# EAGLE design 405_led_jetracer020001S (EAGLE 9.6.2)

## Sheet 1 of 2
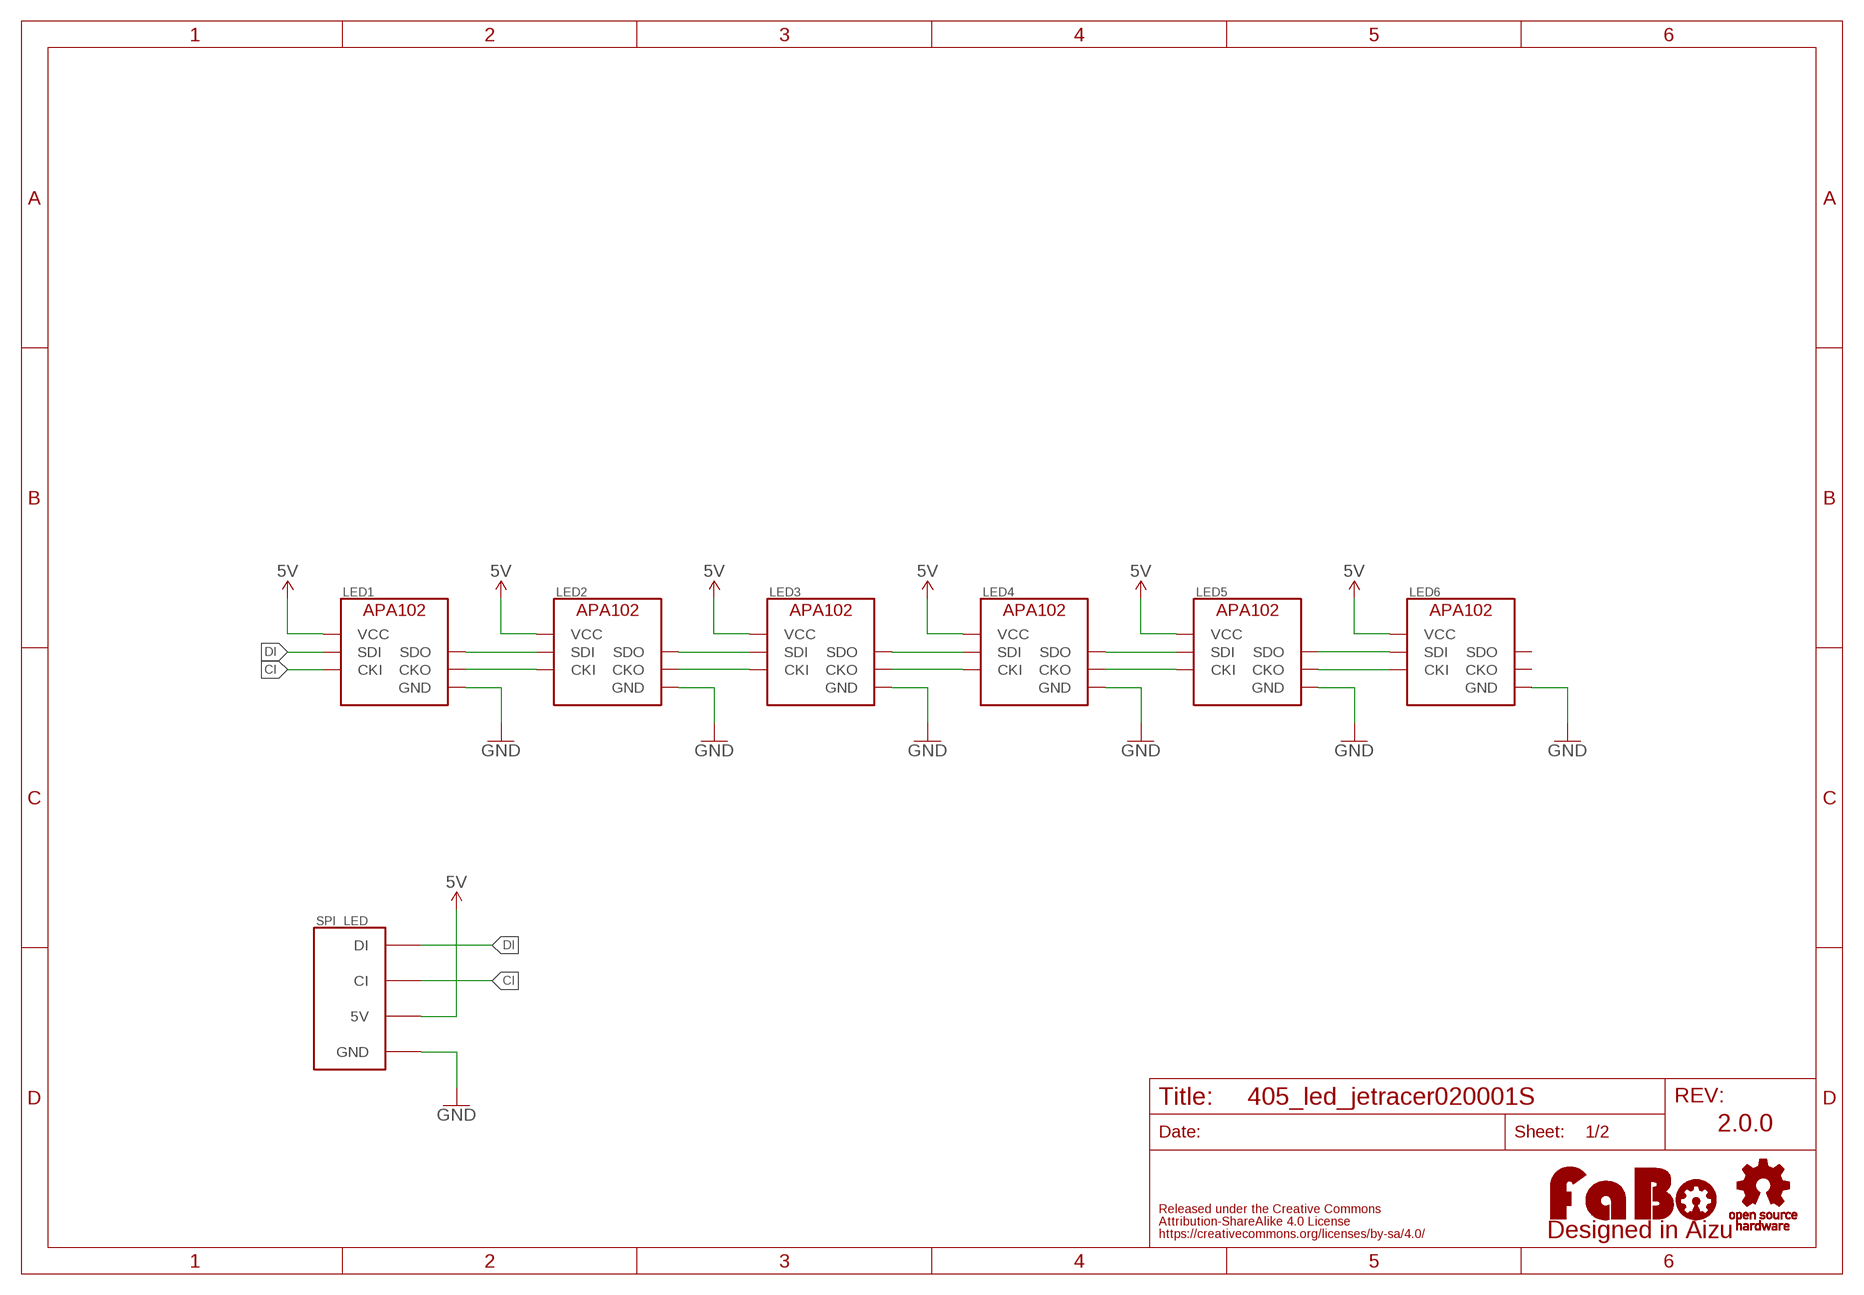
[diagram p0: schematic, sheet 1]

### Parts
LED1  APA102_IPIXEL  [APA102_2020]
LED2  APA102_IPIXEL  [APA102_2020]
LED3  APA102_IPIXEL  [APA102_2020]
LED4  APA102_IPIXEL  [APA102_2020]
LED5  APA102_IPIXEL  [APA102_2020]
LED6  APA102_IPIXEL  [APA102_2020]
LOGO1  LOGO_OSHW-S_BOTTOM  [LOGO_OSHW_S_BOTTOM]
LOGO2  LOGO_FABO-S  [LOGO_FABO_S]
SPI_LED  SPI-LED  FABO_BRICK_SPI_LED-S04B-PASK-2  [FABO_BRICK_SPI_LED_S04B-PASK-2]

### Nets
5V: LED1.VCC LED2.VCC LED3.VCC LED4.VCC LED5.VCC LED6.VCC SPI_LED.5V
CI: LED1.CKI SPI_LED.CI
CI1: LED1.CKO LED2.CKI
CI2: LED2.CKO LED3.CKI
CI3: LED3.CKO LED4.CKI
CI4: LED4.CKO LED5.CKI
CI5: LED5.CKO LED6.CKI
DI: LED1.SDI SPI_LED.DI
DI1: LED1.SDO LED2.SDI
DI2: LED2.SDO LED3.SDI
DI3: LED3.SDO LED4.SDI
DI4: LED4.SDO LED5.SDI
DI5: LED5.SDO LED6.SDI
GND: LED1.GND LED2.GND LED3.GND LED4.GND LED5.GND LED6.GND SPI_LED.GND
Unconnected: LED6.CKO LED6.SDO

### Notes on the sheet
- 2.0.0

## Sheet 2 of 2
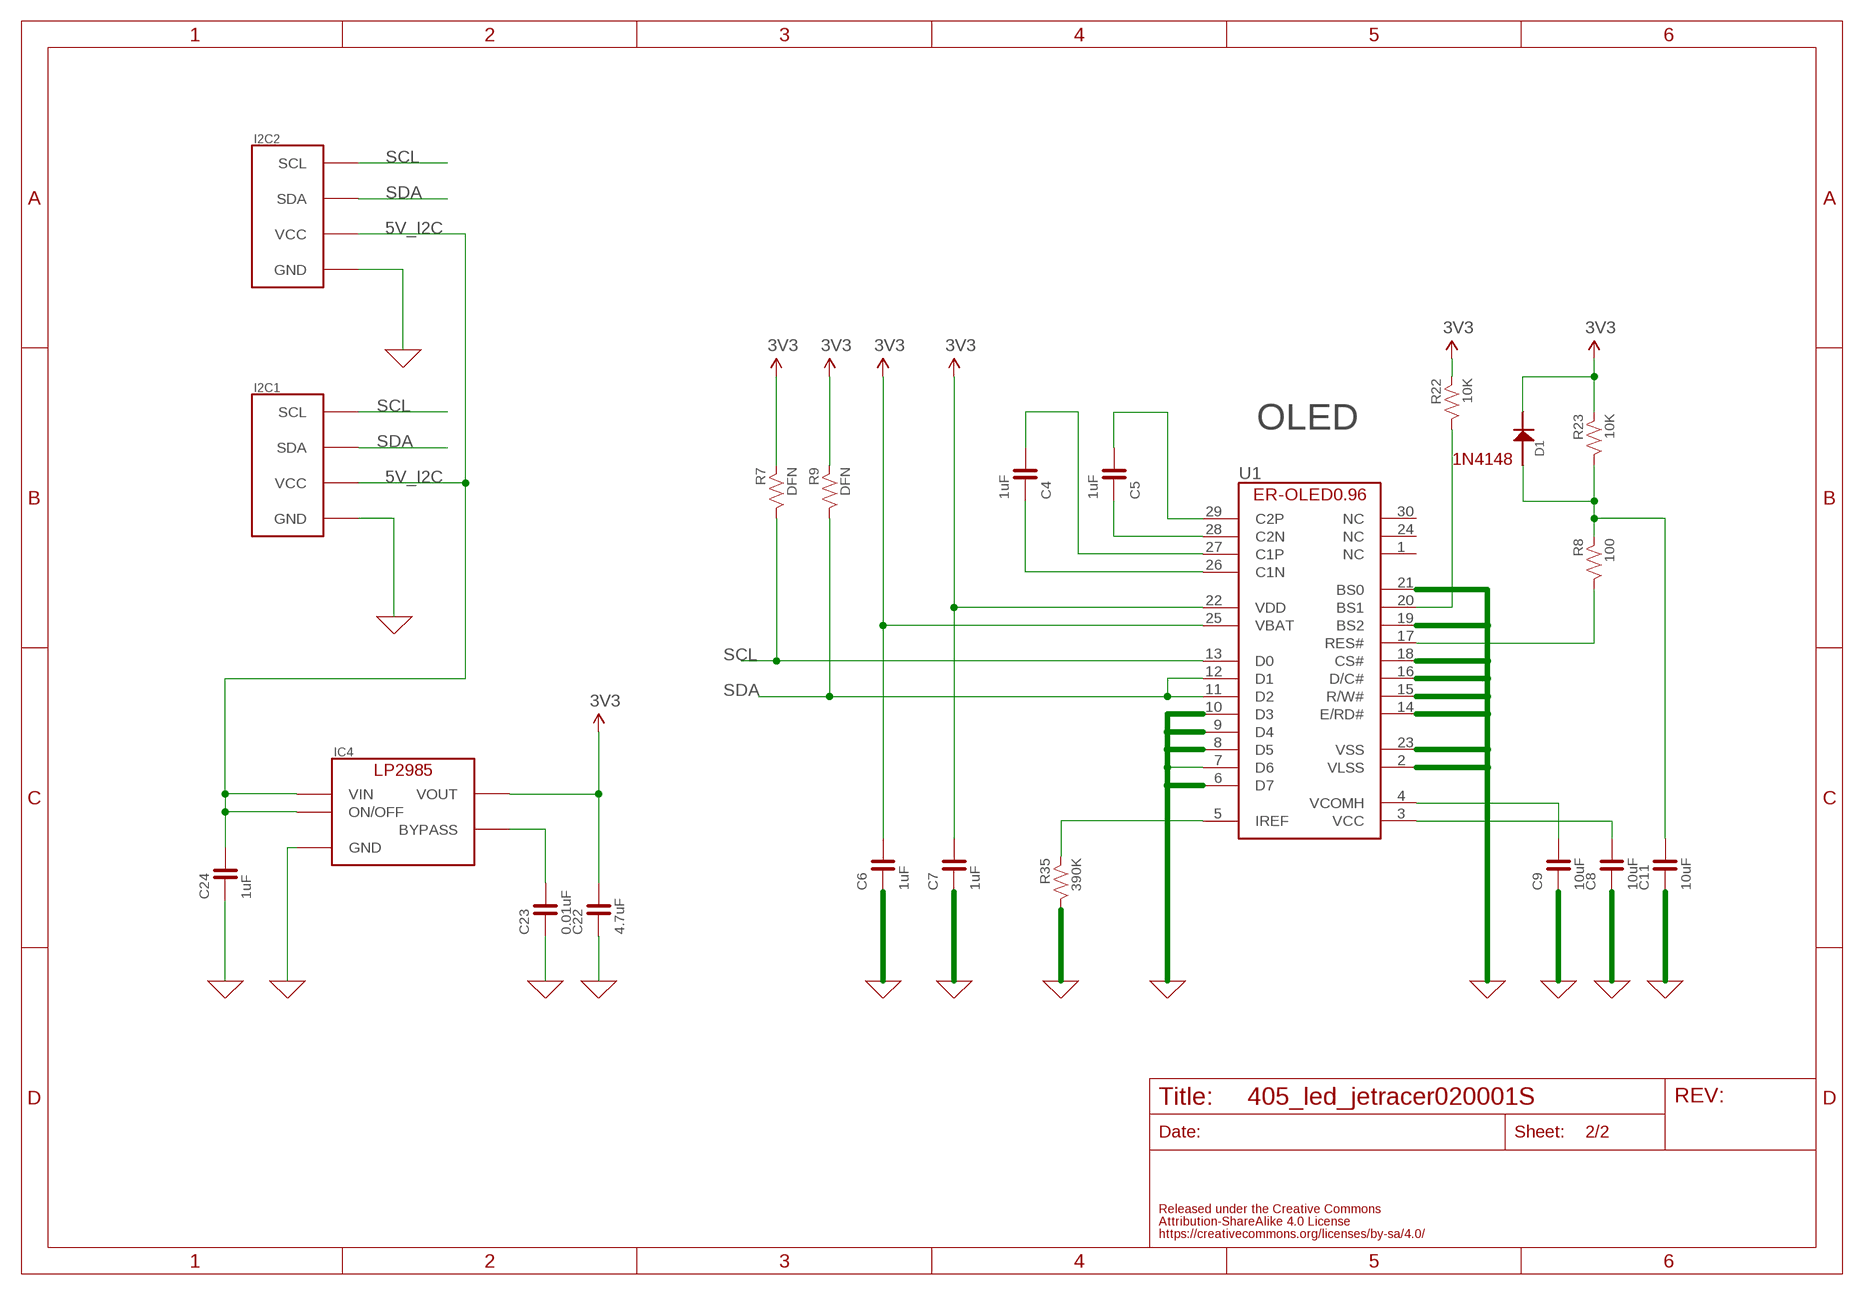
[diagram p1: schematic, sheet 2]

### Parts
C4  1uF  CAPACITOR-0603  [0603]
C5  1uF  CAPACITOR-0603  [0603]
C6  1uF  CAPACITOR-0603  [0603]
C7  1uF  CAPACITOR-0603  [0603]
C8  10uF  CAPACITOR-0603  [0603]
C9  10uF  CAPACITOR-0603  [0603]
C11  10uF  CAPACITOR-0603  [0603]
C22  4.7uF  CAPACITOR-0603  [0603]
C23  0.01uF  CAPACITOR-0603  [0603]
C24  1uF  CAPACITOR-0603  [0603]
D1  1N4148  [1N4148W]
I2C1  FABO_BRICK_I2C-S04B-PASK-2  [FABO_BRICK_I2C_S04B-PASK-2]
I2C2  FABO_BRICK_I2C-S04B-PASK-2  [FABO_BRICK_I2C_S04B-PASK-2]
IC4  LP2985-33DBV  [SOT-23-5]
R7  DFN  RESISTOR-0603  [0603]
R8  100  RESISTOR-0603  [0603]
R9  DFN  RESISTOR-0603  [0603]
R22  10K  RESISTOR-0603  [0603]
R23  10K  RESISTOR-0603  [0603]
R35  390K  RESISTOR-0603  [0603]
U1  ER-OLED0.96-1ER-CON30HT-1  [ER-CON30HT-1]

### Nets
0: C6.1 C7.1 C8.1 C9.1 C11.1 C22.1 C23.1 C24.1 I2C1.GND I2C2.GND IC4.2(GND) R35.2 U1.2(VLSS) U1.6(D7) U1.7(D6) U1.8(D5) U1.9(D4) U1.10(D3) U1.14(E/RD#) U1.15(R/W#) U1.16(D/C#) U1.18(CS#) U1.19(BS2) U1.21(BS0) U1.23(VSS) ; supply symbol labelled GND
3V3: C6.2 C7.2 C22.2 D1.CATHODE IC4.5(VOUT) R7.1 R9.1 R22.1 R23.1 U1.22(VDD) U1.25(VBAT)
5V_I2C: C24.2 I2C1.VCC I2C2.VCC IC4.1(VIN) IC4.3(ON/OFF)
N$2: C23.2 IC4.4(BYPASS)
N$16: C4.2 U1.27(C1P)
N$21: C4.1 U1.26(C1N)
N$22: C5.1 U1.28(C2N)
N$23: C5.2 U1.29(C2P)
N$24: R35.1 U1.5(IREF)
N$25: C9.2 U1.4(VCOMH)
N$26: C8.2 U1.3(VCC)
N$27: R8.2 U1.17(RES#)
N$28: C11.2 D1.ANODE R8.1 R23.2
N$50: R22.2 U1.20(BS1)
SCL: I2C1.SCL I2C2.SCL R7.2 U1.13(D0)
SDA: I2C1.SDA I2C2.SDA R9.2 U1.11(D2) U1.12(D1)
Unconnected: U1.1(NC) U1.24(NC) U1.30(NC)

### Notes on the sheet
- OLED
- 1N4148

## Library data of the parts
C4-C9 C11 C22-C24 = FaBo-Capacitor:CAPACITOR: CAPACITOR
D1 = FaBo-Diode:1N4148
I2C1 I2C2 = FaBo-Template:FABO_BRICK_I2C: FaBo Brick I2C
IC4 = FaBo-Supply:LP2985: LP2985
LED1-LED6 = FaBo-LED:APA102
LOGO1 = FaBo-Logo:LOGO_OSHW
LOGO2 = FaBo-Logo:LOGO_FABO
R7-R9 R22 R23 R35 = FaBo-Resistors:RESISTOR: RESISTOR
SPI_LED = FaBo-Template:FABO_BRICK_SPI_LED
U1 = FaBo-Display:ER-OLED0.96-1

## Board
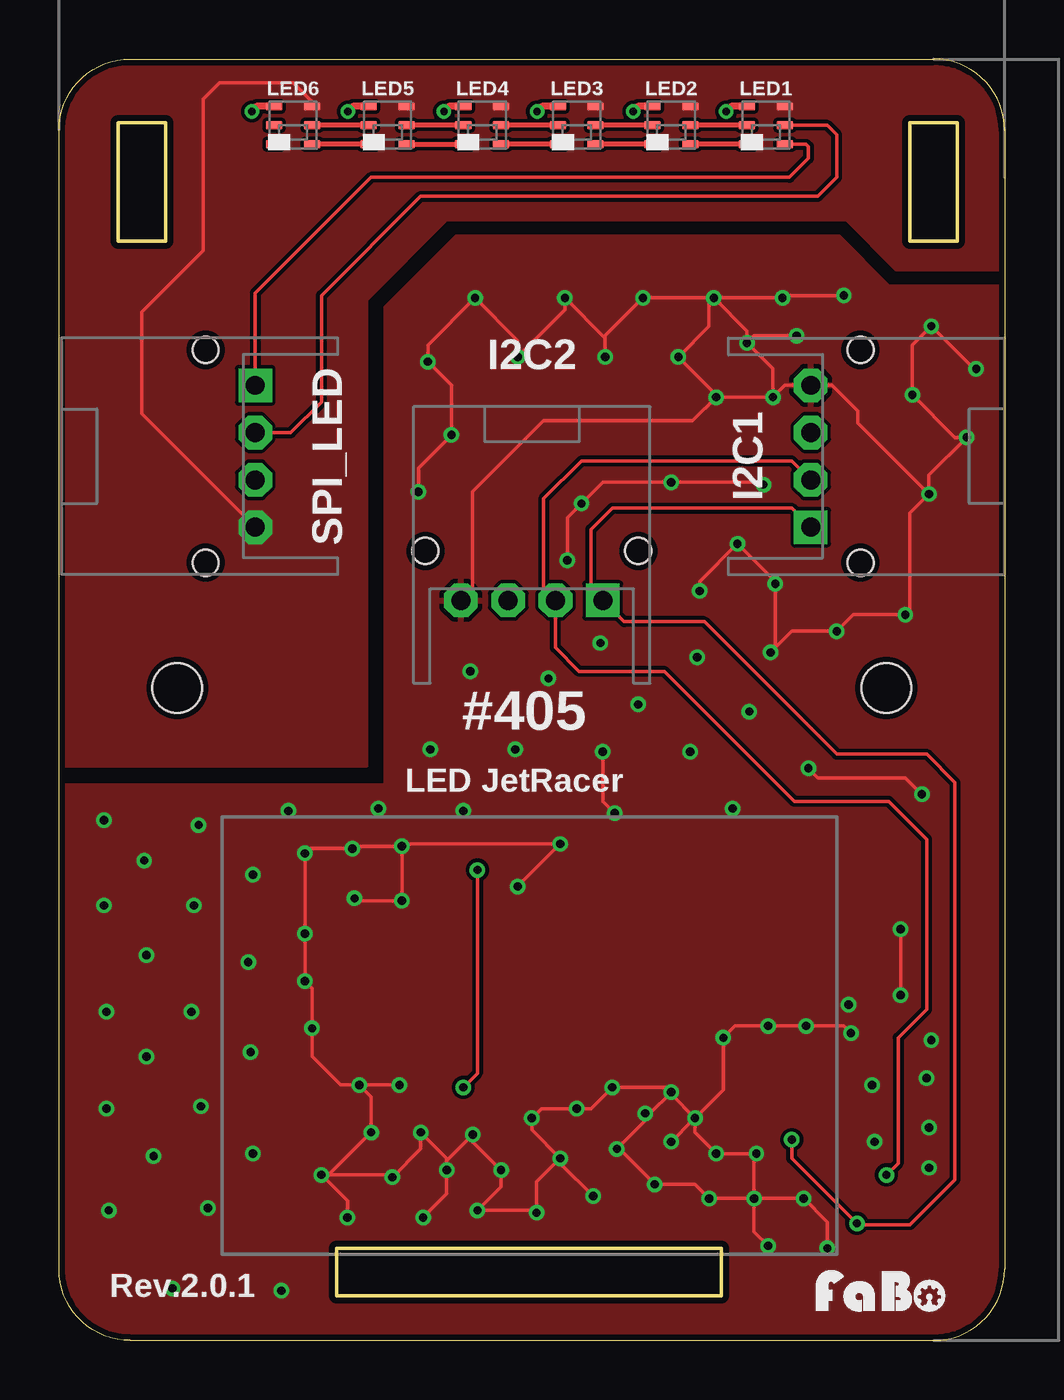
[diagram p2: board, top side]
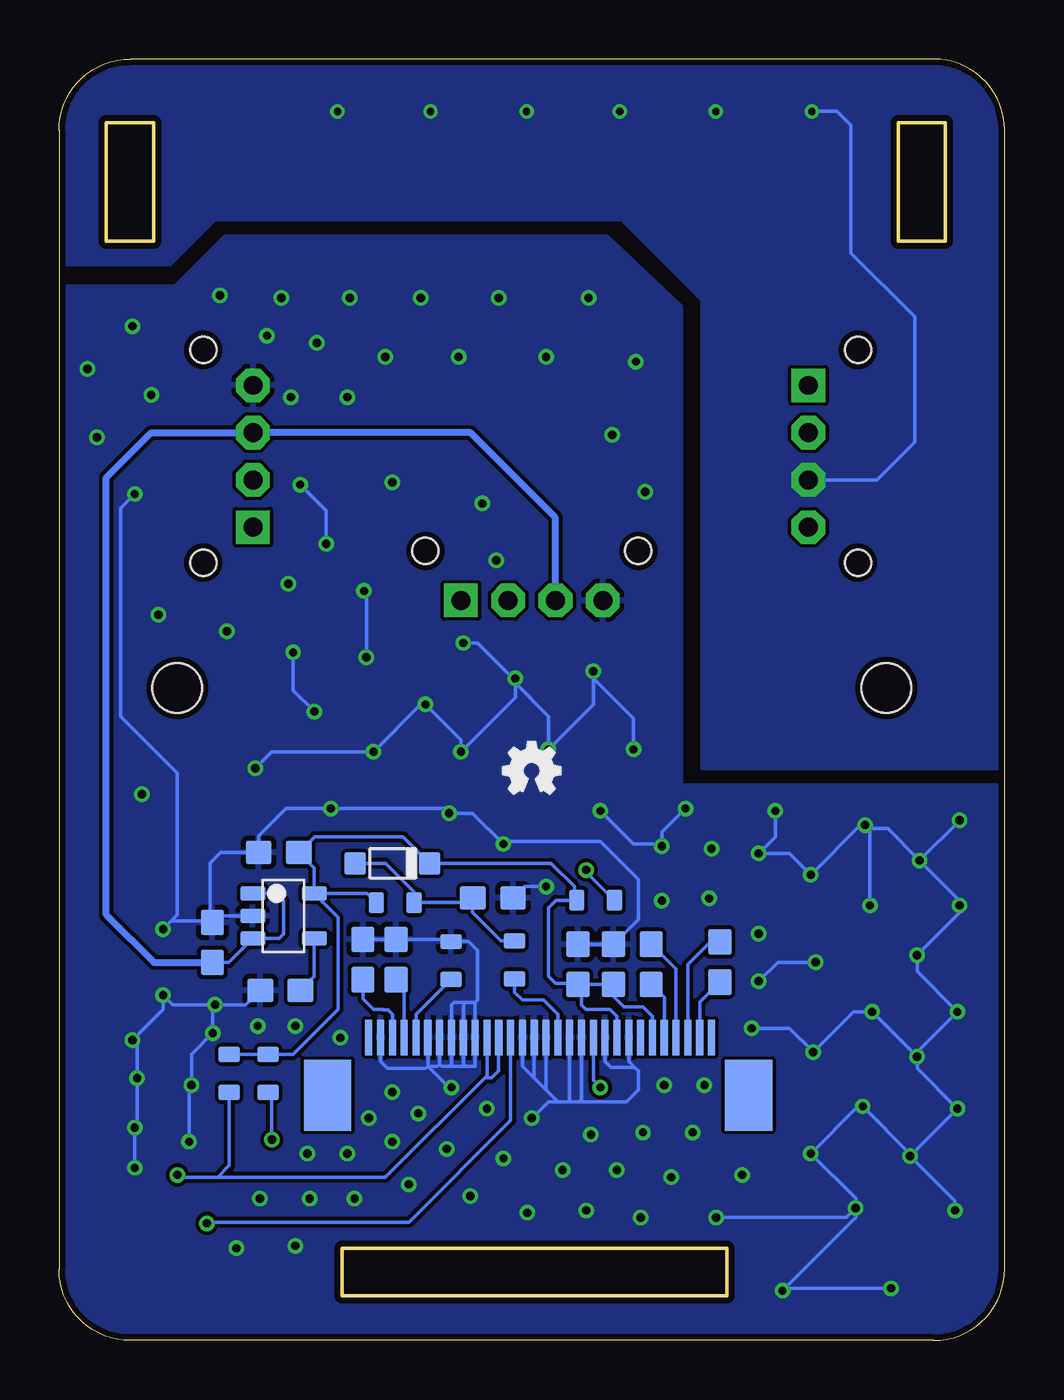
[diagram p3: board, bottom side, seen from below]

Size 40 x 54.2 mm. Coordinates in mm from the lower left corner, seen from the top.
Outline: 3,0 37,0 arc90 40,3 40,51.2 arc90 37,54.2 3,54.2 arc90 0,51.2 0,3 arc90 3,0
Outline: 11.75,1.89 28.03,1.89 28.03,3.9 11.75,3.9 11.75,1.89
Outline: 2.5,51.5 4.5,51.5 4.5,46.5 2.5,46.5 2.5,51.5
Outline: 36,51.5 38,51.5 38,46.5 36,46.5 36,51.5
Copper layers (1*16): Top 0.035mm / dielectric 1.6mm / Bottom 0.035mm
Design rules "PCBway": minimum track width 6mil, minimum drill 12mil, track to track 6mil, track to pad 6mil, pad to pad 6mil, via to via 6mil, smd to smd 6mil, copper to edge 10mil, drill to drill 10mil, minimum pad ring 10mil, minimum via ring 6mil, stop-mask expansion 2mil, vias tented up to drill 100mil, thermal gap 8mil
Holes 2.1 mm at 5,27.6 35,27.6
bRestrict: 8 lines

### Footprints (pad centres in the part's own frame; a part is rotated, then mirrored left to right if it is on the bottom)
0603 = smd 1.1 x 1: 1 -0.85,0; 2 0.85,0
1N4148W = smd 0.9 x 0.95: ANODE 0,0; CATHODE 3.15,0
FABO_BRICK_I2C_S04B-PASK-2 = drill 0.8 pad 1.422 octagon: GND -3,0; SDA 1,0; VCC -1,0 | drill 0.8 pad 1.422 square: SCL 3,0 | hole 1.1: 4.5,2.1; -4.5,2.1
SOT-23-5 = smd 0.6 x 1.05: 1 -0.95,-1.3; 2 0,-1.3; 3 0.95,-1.3; 4 0.95,1.3; 5 -0.95,1.3
APA102_2020 = smd 0.7 x 0.35: CKI 0.8,0; CKO -0.8,0; GND 0.8,0.8; SDI 0.8,-0.8; SDO -0.8,-0.8; VCC -0.8,0.8
0603' = smd 0.65 x 0.9: 1 -0.8,0; 2 0.8,0
FABO_BRICK_SPI_LED_S04B-PASK-2 = drill 0.8 pad 1.422 octagon: 5V -1,0; CI 1,0; GND -3,0 | drill 0.8 pad 1.422 square: DI 3,0 | hole 1.1: 4.5,2.1; -4.5,2.1
ER-CON30HT-1 = smd 0.3 x 1.5 bottom: 1 7,-0.23; 2 6.5,-0.23; 3 6,-0.23; 4 5.5,-0.23; 5 5,-0.23; 6 4.5,-0.23; 7 4,-0.23; 8 3.5,-0.23; 9 3,-0.23; 10 2.5,-0.23; 11 2,-0.23; 12 1.5,-0.23; 13 1,-0.23; 14 0.5,-0.23; 15 0,-0.23; 16 -0.5,-0.23; 17 -1,-0.23; 18 -1.5,-0.23; 19 -2,-0.23; 20 -2.5,-0.23; 21 -3,-0.23; 22 -3.5,-0.23; 23 -4,-0.23; 24 -4.5,-0.23; 25 -5,-0.23; 26 -5.5,-0.23; 27 -6,-0.23; 28 -6.5,-0.23; 29 -7,-0.23; 30 -7.5,-0.23 | smd 2 x 3 bottom: 31 -9.07,-2.67; 32 8.74,-2.67

### Placement (x,y rotation side)
C4  14.95,15.91 90 bottom
C5  12.05,16.01 270 bottom
C6  18.05,15.91 270 bottom
C7  16.55,15.91 270 bottom
C8  27.15,16.11 270 bottom
C9  25.75,16.11 270 bottom
C11  21.65,18.71 180 bottom
C22  30.7,20.64 0 bottom
C23  30.64,14.81 0 bottom
C24  33.52,16.84 270 bottom
D1  27.47,20.18 0 bottom
I2C1  31.8,37.4 270 top
I2C2  20,31.3 0 top
IC4  30.5,17.95 270 bottom
LED1  29.9,51.4 0 top
LED2  25.9,51.4 0 top
LED3  21.9,51.4 0 top
LED4  17.9,51.4 0 top
LED5  13.9,51.4 0 top
LED6  9.9,51.4 0 top
LOGO1  20,24.1 0 top
LOGO2  34.81,1.07 0 top
R7  DFN  [0603']  31.16,11.29 270 bottom
R8  100  [0603']  20.73,16.09 270 bottom
R9  DFN  [0603']  32.8,11.29 270 bottom
R22  10K  [0603']  17.3,18.62 0 bottom
R23  10K  [0603']  25.78,18.52 0 bottom
R35  390K  [0603']  23.41,16.07 90 bottom
SPI_LED  8.3,37.4 90 top
U1  19.9,13.04 0 top

### Tracks (layer width: path | path; a pad name or v marks a point on that pad's centre or on a via)
0  (via drill 0.35)
  Top 0.152: v19.4,19.2 v21.2,21 14.72,21 14.5,20.78 | v11.1,7 12.2,5.9 v12.2,5.2 | 14.5,20.78 v14.5,20.9 12.5,20.9 v12.4,20.8 10.6,20.8 v10.4,20.6 v10.4,17.2 v10.4,15.2 10.7,14.9 v10.7,13.2 10.7,12.01 11.91,10.8 v12.7,10.8 | 14.5,20.78 v14.5,18.6 12.6,18.6 v12.5,18.7 | v12.7,10.8 v14.4,10.8 | v12.7,10.8 13.2,10.3 v13.2,8.8 11.4,7 v11.1,7 | v11.1,7 14,7 v14.1,6.9 15.3,8.1 v15.3,8.8 16.4,7.7 v16.4,7.2 | v16.4,7.2 16.4,6.2 v15.4,5.2 | v16.4,7.2 16.4,7.6 v17.5,8.7 17.5,8.4 v18.7,7.2 18.7,6.5 v17.7,5.5 20.1,5.5 v20.2,5.4 20.2,6.7 v21.2,7.7 | v21.2,7.7 20,8.9 v20,9.4 20.4,9.8 v21.9,9.8 22.5,9.8 v23.4,10.7 25.7,10.7 v25.9,10.5 | v21.2,7.7 21.2,7.5 v22.6,6.1 | v25.9,10.5 25,9.6 v24.8,9.6 24.8,9.3 v23.6,8.1 23.7,8.1 v25.2,6.6 26.9,6.6 v27.5,6 v29.4,6 | v29.4,6 v31.5,6 32.5,5 v32.5,3.9 | v30,4 29.4,4.6 v29.4,6 | v29.4,6 29.4,7.8 v29.5,7.9 v27.8,7.9 26.9,8.8 26.9,9.3 | 26.9,9.3 v26.9,9.4 | v26.9,9.4 25.9,10.4 v25.9,10.5 | v25.9,8.4 26.8,9.3 26.9,9.3 | v26.9,9.4 28.1,10.6 v28.1,12.8 28.6,13.3 v30,13.3 v31.6,13.3 33.2,13.3 v33.5,13 | v35.6,14.6 v35.6,17.4 | v33.2,44.2 30.7,44.2 v30.6,44.1 v27.7,44.1 | v27.7,44.1 29.1,42.7 v29.1,42.2 | v29.1,42.2 29.4,42.5 v31.2,42.5 | v29.1,42.2 30.2,41.1 v30.2,39.9 | v30.2,39.9 27.9,39.9 | 27.9,39.9 v27.8,39.9 26.8,38.9 20.5,38.9 17.5,35.9 17.5,31.8 I2C2.GND | v36.8,35.8 33.8,38.8 33.8,39.3 32.7,40.4 I2C1.GND 30.7,40.4 v30.2,39.9 | 27.5,44.1 v24.7,44.1 23.1,42.5 v23.1,41.6 23.1,42.4 v21.4,44.1 21.4,43.6 v19.4,41.6 19.4,42.3 v17.6,44.1 15.6,42.1 v15.6,41.4 16.6,40.4 v16.6,38.3 15.2,36.9 v15.2,35.9 | 27.5,44.1 v27.7,44.1 | 27.5,44.1 27.5,42.9 v26.2,41.6 27.9,39.9
  Top 0.152: v21.5,33 21.5,34.8 v22.1,35.4 23,36.3 v25.9,36.3 29.7,36.3 v29.8,36.2 | v27.1,31.7 27.1,32.1 v28.7,33.7 30.3,32.1 v30.3,32 30.3,29.3 v30.1,29.1 31,30 v32.9,30 33.6,30.7 v35.8,30.7 36,30.9 36,35 v36.8,35.8 | v36.8,35.8 36.8,36.6 v38.4,38.2 37.9,38.2 v36.1,40 36.1,42.1 v36.9,42.9 38.7,41.1 v38.8,41.1 | v31.7,24.2 32.1,23.8 35.8,23.8 v36.5,23.1 | v23.5,22.3 23,22.8 v23,24.9
  Bottom 0.152: C6.1 C7.1 15.5,17.81 15.5,19.5 17.1,21.1 21.1,21.1 v21.2,21 22.5,22.3 v23.5,22.3 23.7,22.5 v28.5,22.5 30.4,22.5 31.55,21.34 C22.1 33.16,20.64 33.6,20.2 33.6,18.2 33.3,17.9 | 22.4,14.3 22.3,14.4 22.3,16.5 22.67,16.87 R35.2 23.5,16.96 C9.1 C8.1 27.25,17.06 27.4,17.06 | 22.4,14.3 U1.10 22.4,11.6 22.8,11.6 | 22.8,14.3 22.9,14.2 U1.9 22.9,11.7 22.8,11.6 | 22.8,14.3 22.4,14.3 | 22.8,14.3 23.3,14.3 23.4,14.2 U1.8 23.4,11.7 23.5,11.6 | U1.7 23.9,11.7 | 23.9,11.7 23.8,11.6 23.5,11.6 | U1.6 24.4,11.6 | 24.4,11.6 24,11.6 23.9,11.7 | v19.4,19.2 20.31,19.2 C11.1 | 23.5,11.6 22.8,11.6 | U1.23 15.9,11.8 15.65,11.55 | 15.65,11.55 15.5,11.4 15.5,10.6 16,10.1 18,10.1 | 18,10.1 18.4,10.1 | 19.9,11.1 U1.15 | U1.18 18.4,10.1 | U1.19 17.9,10.2 18,10.1 | U1.21 16.9,11.8 16.65,11.55 15.65,11.55 | IC4.2 33.24,17.95 33.3,17.9 | 33.3,17.9 33.45,17.75 | 33.45,17.75 C24.1 | C23.1 32.1,14.2 v33.4,14.2 33.5,14.2 | 18.4,10.1 18.9,10.1 | 18.9,10.1 19.4,10.6 | 19.4,10.6 19.9,11.1 | U1.16 19.4,10.6 | 19.9,11.1 20.4,11.6 U1.14 | 24.4,11.6 23.5,10.7 v23.4,10.7 | 18.9,10.1 19.3,10.1 v20,9.4 | U1.2 26.4,11.8 26.1,11.5 24.5,11.5 24.4,11.6 | 33.5,14.2 35.2,14.2 v35.6,14.6 35.6,14 v36.9,12.7 36.7,12.5 v36.7,11.1 36.7,9.1 v36.8,9 v36.8,7.3 | 33.45,17.75 35.25,17.75 v35.6,17.4 35,18 35,24 37.4,26.4 37.4,35.2 v36.8,35.8 | v34.5,8.4 34.5,10.7 v34.4,10.8 34.4,12.1 v33.5,13 33.5,14.2 | v4.8,2.2 9.3,2.2 v9.4,2.1 6.3,5.2 v6.3,5.6 | v12.2,5.2 6.7,5.2 v6.3,5.6 | v6.3,5.6 6.3,6 v8.2,7.9 6.2,9.9 v6,9.9 4,7.9 | 4,7.9 v4,7.8 2.1,5.9 v2.1,5.5 | 4,7.9 3.9,7.9 v2,9.8 3.7,11.5 v3.7,12 | v3.7,12 3.7,12.2 v2,13.9 3.7,15.6 v3.7,16.3 1.9,18.1 v1.9,18.4 1.9,18.6 v3.6,20.3
  Bottom 0.152: v3.6,20.3 v1.9,22 | v3.7,12 v5.6,13.9 6.4,13.9 v8.1,12.2 9.1,13.2 v10.7,13.2 | v8,16 9.6,16 v10.4,15.2 | v5.7,18.4 5.7,21.6 5.75,21.65 | 5.75,21.65 v5.9,21.8 6.1,21.8 v8.2,19.7 9.1,20.6 v10.4,20.6 9.7,21.3 v9.7,22.4 | v3.6,20.3 4.95,21.65 5.75,21.65 | v13.5,22.5 14.5,21.5 14.5,21 | 14.5,21 v14.5,20.9 | v17.1,22.4 15.7,21 14.5,21 | v28.7,33.7 28.7,35.1 v29.8,36.2 | v27,28.9 27,31.6 v27.1,31.7 | v30.1,29.1 30.1,27.5 v29.2,26.6 | 31.6,24.2 v31.7,24.2 31,24.9 v26.7,24.9 24.7,26.9 v24.5,26.9 23,25.4 v23,24.9 20.7,27.2 v20.7,28 | v20.7,28 20.7,27.8 19.3,26.4 v19.3,25 17.4,26.9 v17.4,28.3 17.4,28 15.7,26.3 v15.7,25 | v20.7,28 20.8,28 22.3,29.5 v22.9,29.5
  pour Bottom: -4,0.1 -4,20.3 -0.8,23.5 13.68,23.5 13.68,43.76 16.8,46.7 33,46.7 35.1,44.6 41.6,44.6 41.7,44.5 41.7,0.4 38.3,-3 -0.9,-3
  pour Top: -6.4,22.3 -5.2,23.5 13.8,23.5 13.8,43.7 16.8,46.7 33,46.7 35.1,44.6 42.8,44.6 43.4,44 43.4,2.4 39.2,-1.8 -3.9,-1.8 -6.4,0.7
3V3
  Bottom 0.152: U1.25 14.9,13.7 15.3,14.1 16.1,14.1 16.55,14.55 C7.2 17.9,15.06 | 17.9,15.06 C6.2 18.09,15.1 19,15.1 19.3,15.4 19.3,18.3 18.98,18.62 18.2,18.62 | U1.22 16.4,13.7 16.7,14 17.7,14 17.9,14.2 17.9,15.06 | 18.2,18.62 R22.1 | 18.2,18.62 18.2,19.2 19.18,20.18 D1.CATHODE 25.44,21.3 29.19,21.3 C22.2 29.2,19.98 IC4.5 | R23.1 26.96,18.91 IC4.5 | R9.1 R7.1 30.11,12.1 28.2,14 28.2,17.9 IC4.5
5V  (via drill 0.3)
  Top 0.305: LED1.VCC 28.43,52.2 v28.22,51.99 | LED2.VCC 24.5,52.2 v24.28,51.99 | LED3.VCC 20.43,52.2 v20.22,51.99 | LED4.VCC 16.5,52.2 v16.28,51.99 | LED5.VCC 12.43,52.2 v12.22,51.99 | LED6.VCC 8.37,52.2 v8.15,51.99
  Bottom 0.152: v12.22,51.99 12.2,52.01 | SPI_LED.5V 5.4,36.4 3.8,38 3.8,43.3 6.5,46 6.5,51.4 7.09,51.99 v8.15,51.99
  pour Bottom (no thermals): -2.7,53.6 2.1,58.4 39.6,58.4 41.7,56.3 41.7,46.5 40.7,45.5 35.3,45.5 33.4,47.4 16.2,47.4 12.8,44 12.8,24.2 -1.4,24.2 -2.7,25.5
5V_I2C
  Bottom 0.152: IC4.1 30.8,18.9 30.5,18.6 30.5,17.2 30.7,17 IC4.3 32.83,15.98 C24.2
  Bottom 0.305: C24.2 35.98,15.98 38,18 38,36.5 36.1,38.4 I2C1.VCC 22.6,38.4 19,34.8 I2C2.VCC
CI
  Top 0.152: SPI_LED.CI 9.8,38.4 11.1,39.7 11.1,44.2 15.3,48.4 32.1,48.4 32.9,49.2 32.9,51 32.5,51.4 LED1.CKI
CI1
  Top 0.203: LED1.CKO LED2.CKI
CI2
  Top 0.203: LED2.CKO LED3.CKI
CI3
  Top 0.203: LED3.CKO LED4.CKI
CI4
  Top 0.203: LED4.CKO LED5.CKI
CI5
  Top 0.203: LED5.CKO LED6.CKI
DI
  Top 0.152: LED1.SDI 31.6,50.6 31.7,50.5 31.7,50 30.9,49.2 13.2,49.2 8.3,44.3 SPI_LED.DI
DI1
  Top 0.203: LED1.SDO LED2.SDI
DI2
  Top 0.203: LED2.SDO LED3.SDI
DI3
  Top 0.203: LED3.SDO LED4.SDI
DI4
  Top 0.203: LED5.SDI LED4.SDO
DI5
  Top 0.203: LED5.SDO LED6.SDI
GND
  Top 0.152: SPI_LED.GND 3.5,39.2 3.5,43.5 6.1,46.1 6.1,52.5 6.8,53.2 9.9,53.2 10.7,52.4 LED6.GND
  pour Top (no thermals): -4.7,56.7 -2.8,58.6 39.4,58.6 43.4,54.6 43.4,48.3 40.4,45.3 35.4,45.3 33.3,47.4 16.4,47.4 13,44 13,24.3 -3.3,24.3 -4.7,25.7
N$2
  Bottom 0.152: C23.2 29.2,15.39 IC4.4
N$16
  Bottom 0.152: U1.27 13.9,15.71 C4.2
N$21
  Bottom 0.152: U1.26 14.4,14.51 C4.1
N$22
  Bottom 0.152: U1.28 13.4,15.9 12.44,16.86 C5.1
N$23
  Bottom 0.152: C5.2 12.9,14.31 U1.29
N$24
  Bottom 0.152: R35.1 24.9,13.79 U1.5
N$25
  Bottom 0.152: U1.4 25.4,14.91 C9.2
N$26
  Bottom 0.152: U1.3 25.9,13.8 26.08,13.98 26.29,13.98 26.3,14 26.7,14 27.15,14.45 C8.2
N$27
  Bottom 0.152: U1.17 18.9,13.8 19.5,14.4 20.4,14.4 20.73,14.73 R8.2
N$28
  Bottom 0.152: R8.1 21.3,16.89 22.5,18.1 C11.2 | C11.2 | C11.2 22.68,18.52 R23.2 24.98,18.98 26.18,20.18 D1.ANODE
N$50  (via drill 0.35)
  Top 0.152: v17.7,19.9 17.7,11.3 v17.1,10.7
  Bottom 0.152: U1.20 17.4,11 v17.1,10.7 | v17.7,19.9 17.7,19.82 R22.2
SCL  (via drill 0.35)
  Top 0.152: v31,8.5 31,7.7 v33.75,4.95 33.8,4.9 36,4.9 37.9,6.8 37.9,23.6 36.7,24.8 32.9,24.8 27.3,30.4 23.9,30.4 I2C2.SCL | 23.1,31.3 I2C2.SCL | I2C2.SCL 22.5,31.8 22.5,34.3 23.4,35.2 31,35.2 I2C1.SCL
  Bottom 0.152: v31,8.5 31,10.34 R7.2 | U1.13 20.9,9.3 25.2,5 33.7,5 v33.75,4.95
SDA  (via drill 0.35)
  Top 0.152: v35,7 35.5,7.5 35.5,12.8 36.7,14 36.7,21.2 35.1,22.8 31.1,22.8 25.6,28.3 22,28.3 21,29.3 I2C2.SDA 20.5,31.8 20.5,35.6 22.1,37.2 31,37.2 I2C1.SDA
  Bottom 0.152: 33.3,6.9 26.2,6.9 21.9,11.2 | 21.9,11.2 21.9,11.1 21.7,11.1 21.4,11.4 U1.12 | 21.9,11.2 U1.11 | R9.2 32.8,7.39 33.3,6.9 | v35,7 34.9,6.9 33.3,6.9

### Text on the board
tPlace: #405 | LED JetRacer | Rev.2.0.1
Document: #405 LED JetRacer Type S Rev2.0.1 / 2022/03/06